# Altium schematic sheet stm32schem.SchDoc
size A3; SheetNumber: 1; SheetTotal: 1
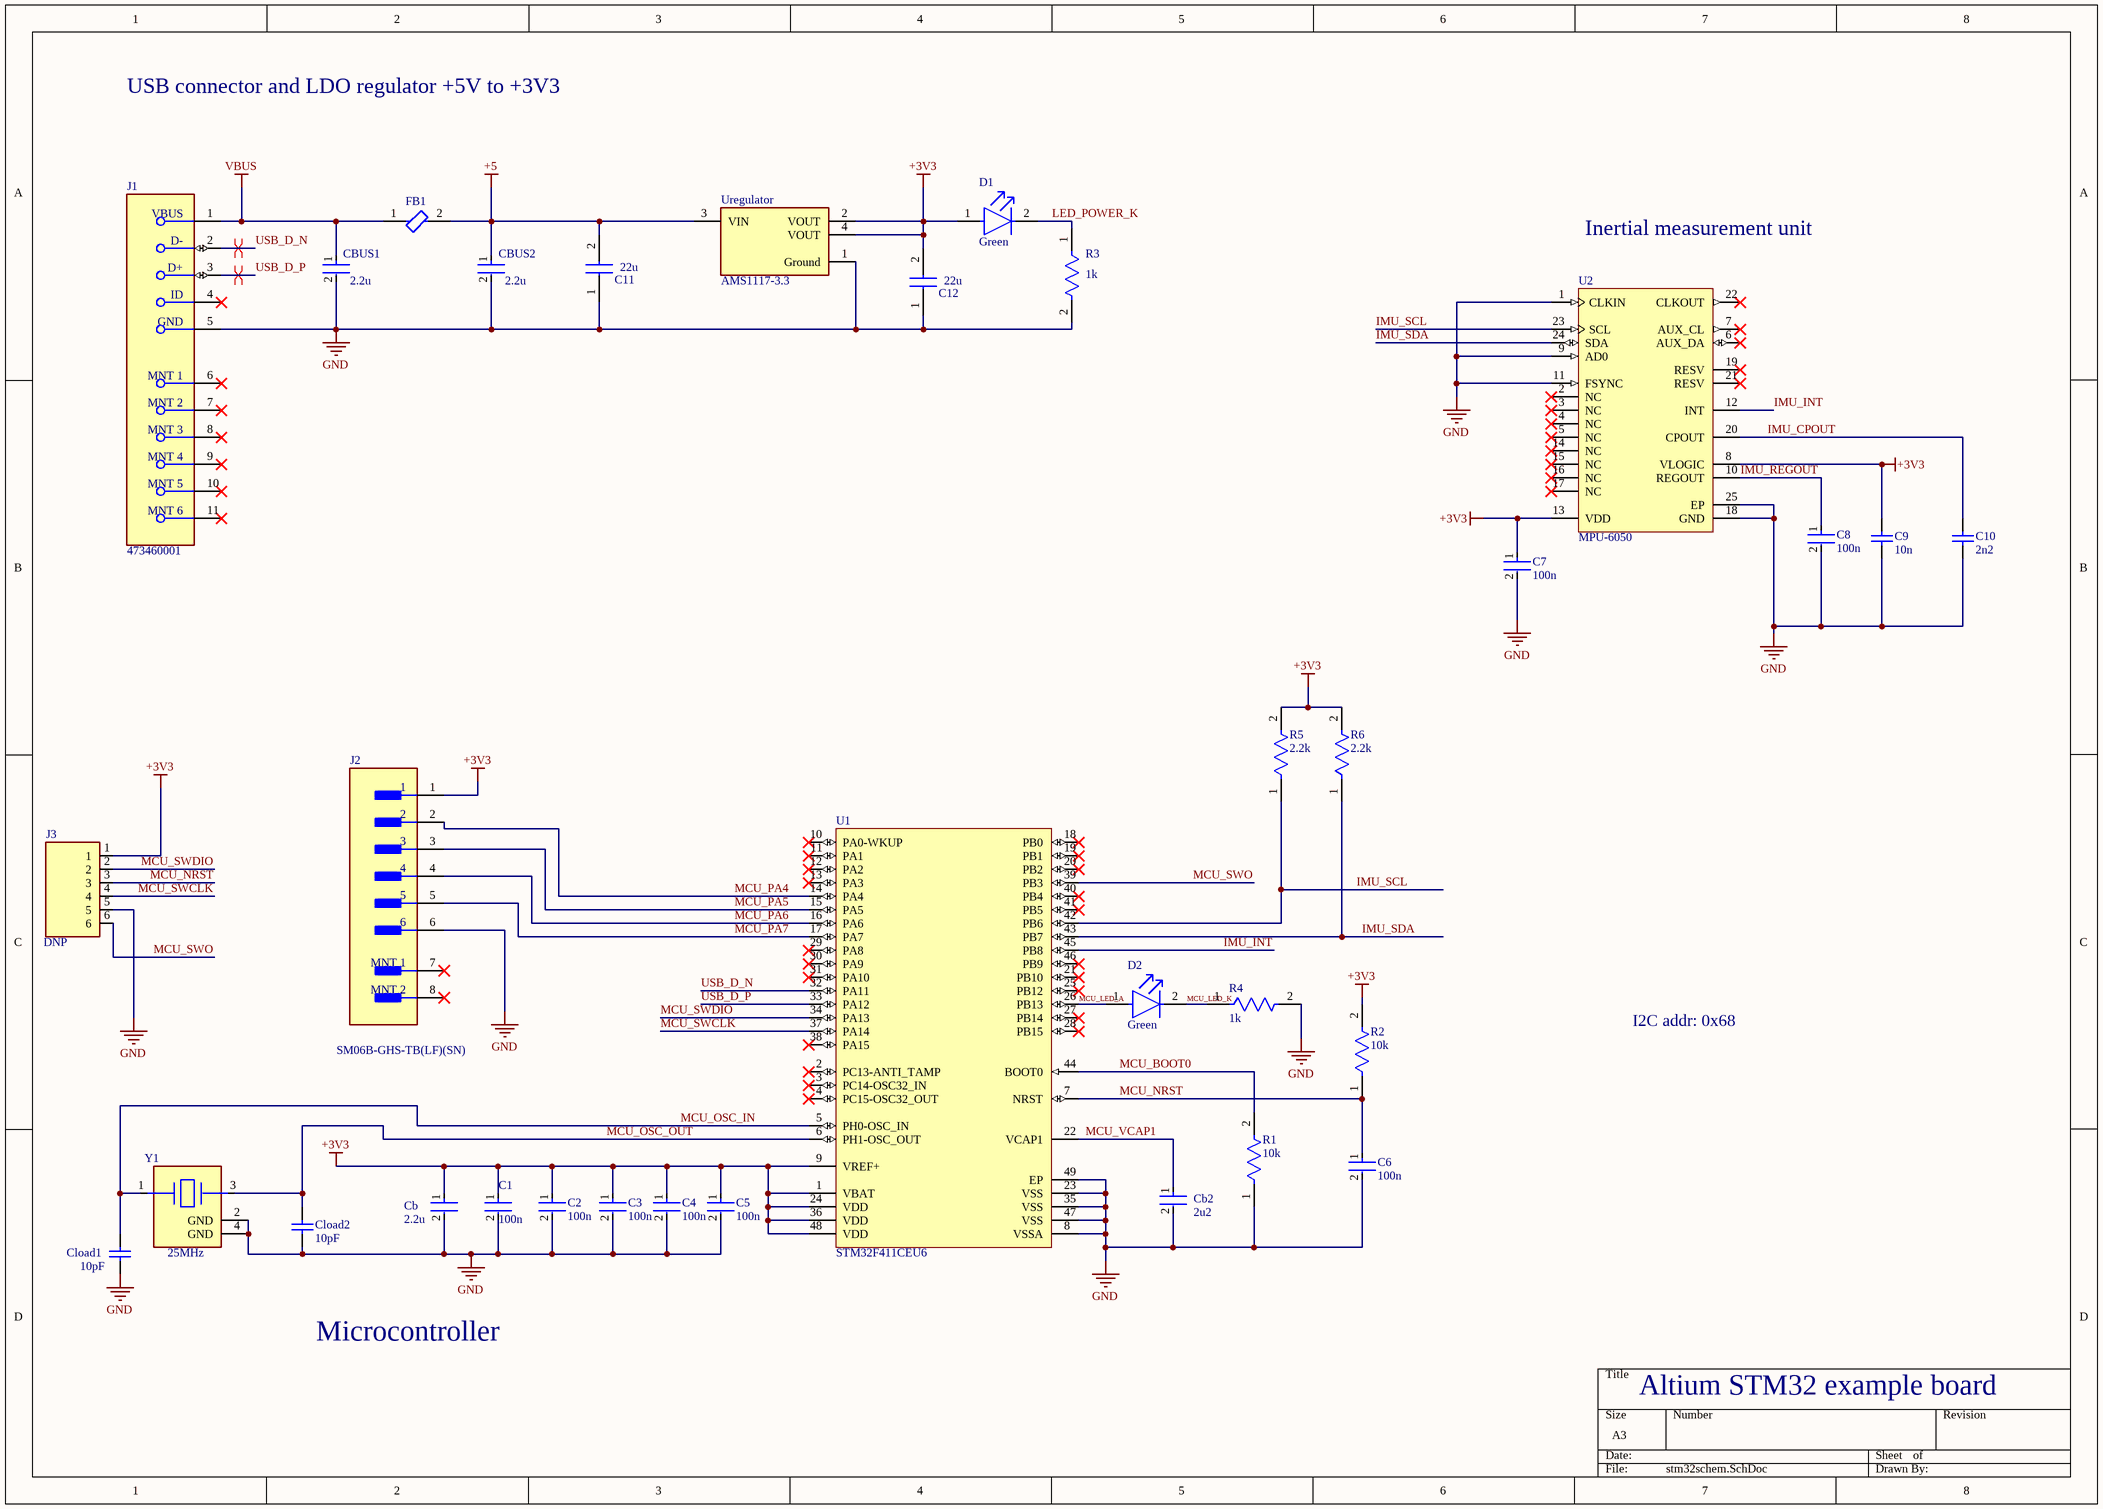
[diagram p0: stm32schem.SchDoc]

## Parts
C1  100n  [FP-0402-L_1_0_0_05-W_0_5-MFG]
C2  100n  [FP-0402-L_1_0_0_05-W_0_5-MFG]
C3  100n  [FP-0402-L_1_0_0_05-W_0_5-MFG]
C4  100n  [FP-0402-L_1_0_0_05-W_0_5-MFG]
C5  100n  [FP-0402-L_1_0_0_05-W_0_5-MFG]
C6  100n  [FP-0402-L_1_0_0_05-W_0_5-MFG]
C7  100n  [FP-0402-L_1_0_0_05-W_0_5-MFG]
C8  100n  [FP-0402-L_1_0_0_05-W_0_5-MFG]
C9  10n  [CAPC1005X56X25ML10T15]
C10  2n2  [CAPC1005X55X25ML05T05]
C11  22u  [CAPC3225X270N]
C12  22u  [CAPC3225X270N]
Cb  2.2u  [FP-0603-L_1_6_0_2-W_0_8_0-IPC_B]
Cb2  2u2  [FP-0603-L_1_6_0_2-W_0_8_0-IPC_B]
CBUS1  2.2u  [FP-0603-L_1_6_0_2-W_0_8_0-IPC_B]
CBUS2  2.2u  [FP-0603-L_1_6_0_2-W_0_8_0-IPC_B]
Cload1  10pF  [CAPC1005X56X25NL10T15]
Cload2  10pF  [CAPC1005X56X25NL10T15]
D1  Green  [FP-SM0402GC-MFG]
D2  Green  [FP-SM0402GC-MFG]
FB1  MPZ1608S101ATAH0  [FP-MPZ1608-0_6-IPC_C]  (value not drawn)
J1  473460001  [FP-473460001-MFG]
J2  SM06B-GHS-TB(LF)(SN)  [FP-SM06B-GHS-TB_LF_SN-MFG]
J3  DNP  [TAG_TC2030-IDC-NL]
R1  10k  [FP-AT0402-IPC_A]
R2  10k  [FP-AT0402-IPC_A]
R3  1k  [FP-TFCR0402-IPC_A]
R4  1k  [FP-TFCR0402-IPC_A]
R5  2.2k  [FP-RT0402-MFG]
R6  2.2k  [FP-RT0402-MFG]
U1  STM32F411CEU6  [STM-UFQFPN48_L]
U2  MPU-6050  [IS-QFN-24_V]
Uregulator  AMS1117-3.3  [FP-AMS1117-IPC_C]
Y1  25MHz  [FP-TSX-3225-MFG]

## Nets
+3V3: C1.1 C2.1 C3.1 C4.1 C5.1 C7.1 C9.2 C12.2 Cb.1 D1.1(A) J2.1 J3.1 R2.2 R5.2 R6.2 U1.1(VBAT) U1.9(VREF+) U1.24(VDD) U1.36(VDD) U1.48(VDD) U2.8(VLOGIC) U2.13(VDD) Uregulator.2(VOUT) Uregulator.4(VOUT)
+5: C11.2 CBUS2.1 FB1.2 Uregulator.3(VIN)
GND: C1.2 C2.2 C3.2 C4.2 C5.2 C6.2 C7.2 C8.2 C9.1 C10.1 C11.1 C12.1 Cb.2 Cb2.2 CBUS1.2 CBUS2.2 Cload1.1 Cload2.1 J1.5(GND) J2.6 J3.5 R1.1 R3.2 R4.2 U1.8(VSSA) U1.23(VSS) U1.35(VSS) U1.47(VSS) U1.49(EP) U2.1(CLKIN) U2.9(AD0) U2.11(FSYNC) U2.18(GND) U2.25(EP) Uregulator.1(Ground) Y1.2(GND) Y1.4(GND)
VBUS: CBUS1.1 FB1.1 J1.1(VBUS)
IMU_CPOUT: C10.2 U2.20(CPOUT)
IMU_INT: U1.45(PB8) U2.12(INT)
IMU_REGOUT: C8.1 U2.10(REGOUT)
IMU_SCL: R5.1 U1.42(PB6) U2.23(SCL)
IMU_SDA: R6.1 U1.43(PB7) U2.24(SDA)
LED_POWER_K: D1.2(C) R3.1
MCU_BOOT0: R1.2 U1.44(BOOT0)
MCU_LED_A: D2.1(A) U1.26(PB13)
MCU_LED_K: D2.2(C) R4.1
MCU_NRST: C6.1 J3.3 R2.1 U1.7(NRST)
MCU_OSC_IN: Cload1.2 U1.5(PH0-OSC_IN) Y1.1
MCU_OSC_OUT: Cload2.2 U1.6(PH1-OSC_OUT) Y1.3
MCU_PA4: J2.2 U1.14(PA4)
MCU_PA5: J2.3 U1.15(PA5)
MCU_PA6: J2.4 U1.16(PA6)
MCU_PA7: J2.5 U1.17(PA7)
MCU_SWCLK: J3.4 U1.37(PA14)
MCU_SWDIO: J3.2 U1.34(PA13)
MCU_SWO: J3.6 U1.39(PB3)
MCU_VCAP1: Cb2.1 U1.22(VCAP1)
USB_D_N: J1.2(D-) U1.32(PA11)
USB_D_P: J1.3(D+) U1.33(PA12)

Not connected (* = marked no-connect by the designer): J1 4(ID)* 6(MNT_1)* 7(MNT_2)* 8(MNT_3)* 9(MNT_4)* 10(MNT_5)* 11(MNT_6)*; J2 7(MNT_1)* 8(MNT_2)*; U1 2(PC13-ANTI_TAMP)* 3(PC14-OSC32_IN)* 4(PC15-OSC32_OUT)* 10(PA0-WKUP)* 11(PA1)* 12(PA2)* 13(PA3)* 18(PB0)* 19(PB1)* 20(PB2)* 21(PB10)* 25(PB12)* 27(PB14)* 28(PB15)* 29(PA8)* 30(PA9)* 31(PA10)* 38(PA15)* 40(PB4)* 41(PB5)* 46(PB9)*; U2 2(NC)* 3(NC)* 4(NC)* 5(NC)* 6(AUX_DA)* 7(AUX_CL)* 14(NC)* 15(NC)* 16(NC)* 17(NC)* 19(RESV)* 21(RESV)* 22(CLKOUT)*

## Layout directives
differential pair; differential pair class DIFF_USB: USB_D_N, USB_D_P

## Notes on the sheet
- USB connector and LDO regulator +5V to +3V3
- Inertial measurement unit
- I2C addr: 0x68
- Microcontroller
- Altium STM32 example board

## Library data of the parts
C1-C8 = CMP-14477-001971-2: None
C9 = CMP-2008-02553-1: Part Number: 04023G103ZAT2A; Manufacturer: AVX Interconnect / Elco
C10 = CMP-2008-01291-1: Part Number: VJ0402Y222JXQPW1BC; Manufacturer: Vitramon
C11 C12 = CL32A226KOJNNNE: Capacitor; Manufacturer_Name: SAMSUNG; Datasheet Link: https://ad.componentsearchengine.com/Datasheets/2/CL32A226KOJNNNE.pdf; Height: 2.7mm; Manufacturer_Part_Number: CL32A226KOJNNNE
Cb Cb2 CBUS1 CBUS2 = CMP-14477-003150-2: None; Voltage Rating: 16V; Tolerance: 20%; Capacitance: 2.2uF; RoHS Compliant: Yes; Min Operating Temperature: -55°C; Mount: Surface Mount; Packaging: Cut Tape; Max Operating Temperature: 85°C; Case/Package: 0603
Cload1 Cload2 = CMP-2008-02993-1: Part Number: LD025A100JAB2A; Manufacturer: AVX Interconnect / Elco
D1 D2 = CMP-35283-000001-2: LED GREEN CLEAR 0402 SMD; Lens Size: 1mm; Luminous Intensity: 28.5mcd; Viewing Angle: 130°; Forward Voltage: 1.9V; Test Current: 20mA; Lens Color: Colorless; Lens Style: Flat; Dominant Wavelength: 572nm; Case Code (Metric): 1005; Mount: Surface Mount; Case Code (Imperial): 0402; Length: 1mm; Width: 0.5mm; Case/Package: 0402; Lens Transparency: Clear; Height: 0.71mm; Packaging: Tape and Reel; Color: Green
FB1 = CMP-08257-000005-2: FERRITE BEAD 100 OHM 0603 1LN; Max DC Current: 3A; Tolerance: 25%; Impedance: 100R; DC Resistance (DCR): 30mR; Packaging: Tape and Reel; Length: 0.063inch; Depth: 0.8mm; Current Rating: 3A; Mount: Surface Mount; Width: 0.031inch; Case Code (Imperial): 0603; Case Code (Metric): 1608; Height: 0.03inch; Core Material: Ferrite; REACH SVHC: No SVHC; Package Quantity: 4000; RoHS Compliant: Yes; Case/Package: 0603
J1 = CMP-2000-05246-2: CONN RCPT USB2.0 MICRO B SMD R/A; Manufacturer: Molex; Conn Orientation: Right Angle; Is Female: yes; Shielding: true; Pitch: 0.65mm; Number Of Contacts: 5; Voltage Rating: 30V; Current Rating: 1.8A; Device Class L2: USB Connectors; Digikey Description: CONN RCPT USB2.0 MICRO B SMD R/A; Height: 2.945mm; RoHS: TRUE; ComponentLink2Description: Datasheet; Octopart: https://octopart.com/47346-0001-molex-7164928; Automotive: No; Package: 0; Category: Conn; Device Class L1: Connectors; Usb Standard: USB 2.0; Temperature: -30°C to +85°C; Temperature Range Low: -30°C; Footprint Url: https://www.molex.com/pdm_docs/sd/473460001_sd.pdf; ComponentLink2URL: https://www.molex.com/webdocs/datasheets/pdf/en-us/0473460001_IO_CONNECTORS.pdf; Lead Free: Yes; Manufacturer Part Number: 473460001; Contact Material: Gold,Nickel; Temperature Range High: +85°C; Device Class L3: unset
J2 = CMP-17439-000061-1: CONN HEADER SMD R/A 6POS 1.25MM; Number of Contacts: 6; Voltage Rating: 50V; Current Rating: 1A; Connector Type: Outer Shroud Contact; Contact Resistance: 50mR; Orientation: Right Angle; Max Operating Temperature: 85°C; Mount: Surface Mount; Packaging: Tape and Reel; Contact Plating: Tin; Depth: 4.05mm; Max Voltage Rating (AC): 50V; Lead Free: Lead Free; Pitch: 1.25mm; Number of Positions: 6; Max Current Rating: 1A; Termination: Solder; Min Operating Temperature: -25°C; Housing Color: Beige; Fastening Type: Ramp; Length: 10.75mm; Color: Natural; Contact Material: Bronze; Housing Material: Polyamide; Number of Rows: 1
J3 = CMP-009-000001-1: CABLE ADAPTER 6 POS; Design Item ID: TC2030-IDC-NL; Value: *; Price: None; Pin Count: 6; Package: None; Component Type: Standard; Availability: Unavailable; Source: TC2030-IDC-NL.SchLib; MP: TC2030-IDC-NL
R1 R2 = CMP-03412-043449-1: Thin Film Chip Resistors Automotive Grade 10kΩ 0.5% 25ppm/°C 0402; Resistance: 10kR; Max Power Dissipation: 63mW; Tolerance: 0.5%; Temperature Coefficient: 25ppm/°C; Width: 0.02inch; RoHS Compliant: Yes; Min Operating Temperature: -55°C; Height: 0.014inch; Case Code (Metric): 1005; Ratings: AEC-Q200; Case/Package: 0402; Max Operating Temperature: 155°C; Number of Terminations: 2; Features: Moisture Resistant; Packaging: Cut Tape; Length: 0.039inch; Series: AT; Resistor Type: Thin Film; Case Code (Imperial): 0402
R3 R4 = CMP-250906-247784-1: RES Thin Film,  1kΩ, 0.5%, 0.063W, 25ppm/°C, 0402
R5 R6 = CMP-03412-019720-1: RES SMD 2.2K OHM 0.1% 1/16W 0402; Manufacturer: Yageo; Manufacturer Part Number: RT0402BRE072K2L; Power Rating: 0.063W; Temperature Coefficient: 50 ppm/°C; Value: 2.2KΩ; Tolerance: 0.001; Voltage Rating: 50V; ComponentLink2URL: http://www.yageo.com/documents/recent/PYu-RT_1-to-0.01_RoHS_L_9.pdf; RoHS: TRUE; Device Class L3: Chip SMD Resistors; Category: Res; Ipc Land Pattern Name: RESC10050X30; Series: RT; Lead Free: Yes; Device Class L1: Passive Components; Temperature Range Low: -55°C; Package: RT0402; Automotive: No; Octopart: https://octopart.com/rt0402bre072k2l-yageo-1445889; Temperature: -55°C to +155°C; Footprint Url: http://www.yageo.com/exep/pages/download/literatures/PYu-R_Mount_10.pdf; Composition: Thin Film; Resistance: 2.2KΩ; Temperature Range High: +155°C; Digikey Description: RES SMD 2.2K OHM 0.1% 1/16W 0402; Device Class L2: Resistors; ComponentLink2Description: Datasheet; Height: 0.35mm
U1 = CMP-0243-00165-1: ARM Cortex-M4 32-bit MCU+FPU, 512 KB Flash, 128 KB RAM, 36 I/Os, 48-Pin UFQFPN, -40 to 85 degC, Tray; Operating Frequency(F) (Processor speed) (MHz): 100; FLASH Size (Prog) (kB): 512; Internal RAM Size (kB): 128; I/Os (High Current): 36; Supply Voltage(Vcc) min (V): 1.7; Package Reference: 48-Pin Ultra Thin Fine Pitch Quad Flat No-Lead, 7 x 7 x 0.6 mm Body, 0.5 mm Pitch, Exposed Pad; ComponentLink1Description: Manufacturer URL; ComponentLink1URL: http://www.st.com/; Packing: Tray; Package Description: UFQFPN48; Core: ARM Cortex-M4; ComponentLink2Description: Datasheet; ComponentLink2URL: http://www.st.com/st-web-ui/static/active/en/resource/technical/document/datasheet/DM00115249.pdf; DatasheetVersion: Rev. 6; Mounting Technology: Surface Mount
U2 = CMP-1753-00002-2: 3-Axis Gyroscope, Accelerometer and a Digital Motion Processor(TM) (DMP), 2.375 to 3.46 V, -40 to 85 degC, 24-Pin QFN, RoHS, Tape and Reel; Manufacturer: InvenSense; Featured Product: MPU-60506-Axis,IntegratedI²CSolution; Other Names: 1428-1007-2 / MPU6050; Sensor Type: MotionTracking; Online Catalog: MPU-6000™Series; Unit PriceUSD: Digital; Datasheet Version: Rev. 3.3, 05/2012; Category: Sensors,Transducers; Datasheet URL: http://datasheet.octopart.com/MPU-6050-InvenSense-datasheet-14421344.pdf; Family: Multifunction; Standard Package: 5,000; Manufacturer URL: http://www.invensense.com/; Output Type: Digital; Dynamic Catalog: MPU-6000™Series
Uregulator = CMP-209535-000001-1: LDO Voltage Regulators 1A, 3.3V; Manufacturer: Advanced Monolithic Systems; Dropout Voltage: 1.1V; Output Type: Fixed; Nominal Supply Current: 5mA; Max Power Dissipation: 1.2W; Max Supply Voltage: 15V; Number Of Outputs: 1; Standoff Height: 0.64mm; Max Junction Temp: +125°C; Height: 1.8mm; Package: AMS1117; Device Class L2: Power Management ICs; ComponentLink2Description: Datasheet; ComponentLink2URL: http://www.advanced-monolithic.com/pdf/ds1117.pdf; Category: IC; RoHS: TRUE; Automotive: No; Device Class L1: Integrated Circuits (ICs); Output Current: 1A; Device Class L3: Voltage Regulators - Linear; Temperature: -40°C to +125°C; Output Voltage: 3.3V; Manufacturer Part Number: AMS1117-3.3; Temperature Range Low: -40°C; Octopart: https://octopart.com/ams1117-3.3-advanced+monolithic+systems-25899300; Lead Free: Yes; Ipc Land Pattern Name: SOT229P700X180-4; Temperature Range High: +125°C
Y1 = CMP-36405-000018-1: CRYSTAL 24.0000MHZ 9PF SMD; ESR (Equivalent Series Resistance): 40R; Frequency Stability: 20ppm; Frequency: 24MHz; Tolerance: 10ppm; Drive Level: 200uW; Min Operating Temperature: -40°C; RoHS Compliant: Yes; Width: 2.5mm; Max Operating Temperature: 105°C; Package Quantity: 250; Load Capacitance: 9pF; Mount: Surface Mount; Lead Free: Lead Free; Height: 0.024inch; Depth: 2.5mm; Packaging: Tape and Reel; Series: TSX-3225; Weight: 0.000564oz; Number of Pins: 4; Termination: SMD/SMT; Case/Package: SMD/SMT; Length: 3.2mm; Frequency Tolerance: 10ppm